# Altium schematic sheet TC4056Charge.SchDoc
size A4
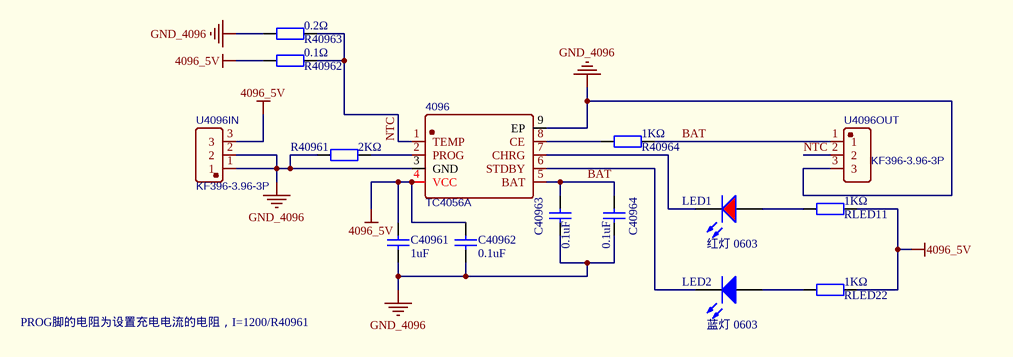
[diagram p0: TC4056Charge.SchDoc]

## Parts
4096  TC4056A  [SOP-8_L4.9-W3.9-P1.27-LS6.0-BL-EP]
C40961  1uF  [1206_C]
C40962  0.1uF  [1206_C]
C40963  0.1uF  [1206_C]
C40964  0.1uF  [1206_C]
LED1  红灯 0603  [0603_LED_S1]
LED2  蓝灯 0603  [0603_LED_S1]
R40961  2KΩ  [1206_R]
R40962  0.1Ω  [1206_R]
R40963  0.2Ω  [1206_R]
R40964  1KΩ  [1206_R]
RLED11  1KΩ  [1206_R]
RLED22  1KΩ  [1206_R]
U4096IN  KF396-3.96-3P  [CONN-TH_3P-P3.96_KF396-3.96-3P]
U4096OUT  KF396-3.96-3P  [CONN-TH_3P-P3.96_KF396-3.96-3P]

## Nets
4096_5V: 4096.4(VCC) C40961.2 C40962.2 R40962.1 RLED11.2 RLED22.2 U4096IN.3
GND_4096: 4096.3(GND) 4096.9(EP) C40961.1 C40962.1 C40963.1 C40964.1 R40961.1 R40963.1 U4096IN.1 U4096IN.2 U4096OUT.3
BAT: 4096.5(BAT) C40963.2 C40964.2 R40964.2 U4096OUT.1
NTC: 4096.1(TEMP) R40962.2 R40963.2 U4096OUT.2
Net4096_2: 4096.2(PROG) R40961.2
Net4096_6: 4096.6(STDBY) LED2.K
Net4096_7: 4096.7(CHRG) LED1.K
Net4096_8: 4096.8(CE) R40964.1
NetLED1_A: LED1.A RLED11.1
NetLED2_A: LED2.A RLED22.1

## Notes on the sheet
- PROG脚的电阻为设置充电电流的电阻，I=1200/R40961

## Library data of the parts
4096 = TC4056A: BOM_Manufacturer: FM; SMT Type: Extend; BOM_Supplier: LCSC; BOM_Manufacturer Part: TC4056A; BOM_Supplier Part: C84051; BOM_LCSC Assembly: Yes; spicePre: U; spiceSymbolName: TC4056A
C40961-C40964 = 1206 1uF (105) 10% 50V: 贴片电容; ComponentLink1Description: 供应商链接; ComponentLink1URL: http://www.szlcsc.com/product/details_2200.html; Package: 1206; Supplier: LC; SuppliersPartNumber: C1848
LED1 = 0603 红灯: 发光二极管; ComponentLink1Description: 供应商链接; ComponentLink1URL: http://www.szlcsc.com/product/details_2659.html; Package: 0603; Supplier: LC; SuppliersPartNumber: C2286
LED2 = 0603 蓝灯: 发光二极管; ComponentLink1Description: 供应商链接; ComponentLink1URL: http://www.szlcsc.com/product/details_73150.html; Package: 0603; Supplier: LC; SuppliersPartNumber: C72041
R40961-R40964 RLED11 RLED22 = 1206 0.1Ω (R100) 1%: 贴片电阻; ComponentLink1Description: 供应商链接; ComponentLink1URL: http://www.szlcsc.com/product/details_26077.html; Package: 1206; Supplier: LC; SuppliersPartNumber: C25334
U4096IN U4096OUT = KF396-3.96-3P: BOM_Manufacturer: Cixi Kefa Elec; Contributor: LCSC; BOM_Supplier: LCSC; BOM_Supplier Part: C474895; BOM_Manufacturer Part: KF396-3.96-3P; spicePre: U; spiceSymbolName: KF396-3.96-3P